# Altium schematic sheet 06)LCD.SchDoc
size 292 x 193 mm
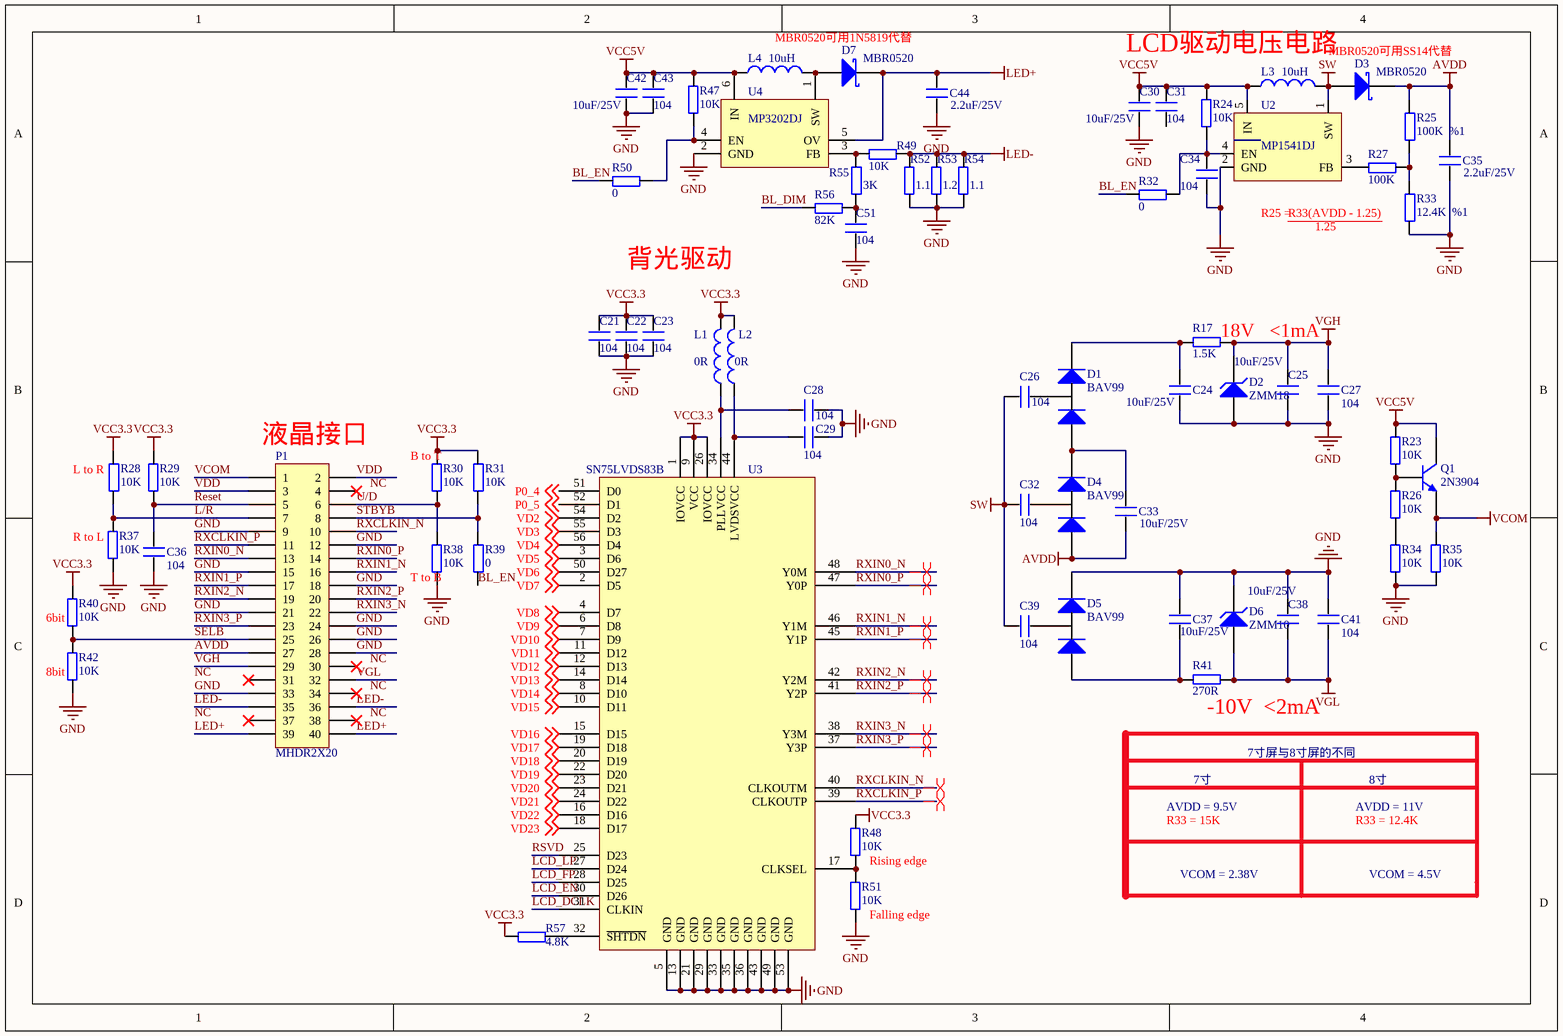
[diagram p0: 06)LCD.SchDoc]

## Parts
C21  104  [0603P]
C22  104  [0603P]
C23  104  [0603P]
C24  10uF/25V  [1206]
C25  10uF/25V  [1206]
C26  104  [0603P]
C27  104  [0603P]
C28  104  [0603P]
C29  104  [0603P]
C30  10uF/25V  [1206]
C31  104  [0603P]
C32  104  [0603P]
C33  10uF/25V  [1206]
C34  104  [0603P]
C35  2.2uF/25V  [1206]
C36  104  [0603P]
C37  10uF/25V  [1206]
C38  10uF/25V  [1206]
C39  104  [0603P]
C41  104  [0603P]
C42  10uF/25V  [1206]
C43  104  [0603P]
C44  2.2uF/25V  [1206]
C51  104  [0603P]
D1  BAV99  [SOT-23-3L]
D2  ZMM18  [LL-34]
D3  MBR0520  [DSO-C2/X2.3]
D4  BAV99  [SOT-23-3L]
D5  BAV99  [SOT-23-3L]
D6  ZMM10  [LL-34]
D7  MBR0520  [DSO-C2/X2.3]
L1  value 0R  [0603P]  (hidden comment: Inductor)
L2  value 0R  [0603P]  (hidden comment: Inductor)
L3  value 10uH  [1206]  (hidden comment: Inductor)
L4  value 10uH  [1206]  (hidden comment: Inductor)
P1  MHDR2X20  [FH12A-40S-0.5SH]
Q1  2N3904  [SOT-23-3L]
R17  1.5K  [0603P]
R23  10K  [0603P]
R24  10K  [0603P]
R25  100K  %1  [0603P]
R26  10K  [0603P]
R27  100K  [0603P]
R28  10K  [0603P]
R29  10K  [0603P]
R30  10K  [0603P]
R31  10K  [0603P]
R32  0  [0603P]
R33  12.4K  %1  [0603P]
R34  10K  [0603P]
R35  10K  [0603P]
R37  10K  [0603P]
R38  10K  [0603P]
R39  0  [0603P]
R40  10K  [0603P]
R41  270R  [0603P]
R42  10K  [0603P]
R47  10K  [0603P]
R48  10K  [0603P]
R49  10K  [0603P]
R50  0  [0603P]
R51  10K  [0603P]
R52  1.1  [0603P]
R53  1.2  [0603P]
R54  1.1  [0603P]
R55  3K  [0603P]
R56  82K  [0603P]
R57  4.8K  [0603P]
U2  MP1541DJ  [SOT-23-5L]
U3  SN75LVDS83B  [DGG056]
U4  MP3202DJ  [SOT-23-6L]

## Nets
AVDD: C33.2 C35.1 D3.2(K) D4.1(A) P1.27 R25.2
GND: C21.1 C22.1 C23.1 C24.2 C25.2 C27.2 C28.1 C29.1 C30.2 C34.1 C35.2 C36.1 C37.1 C38.1 C41.1 C42.2 C43.1 C44.2 C51.1 D2.1(A) D5.2(K) D6.2(K) P1.9 P1.12 P1.15 P1.18 P1.21 P1.24 P1.26 P1.28 P1.33 R33.1 R34.2 R35.2 R37.2 R38.2 R42.2 R51.2 R52.2 R53.2 R54.2 U2.2(GND) U3.5(GND) U3.13(GND) U3.21(GND) U3.29(GND) U3.33(GND) U3.35(GND) U3.36(GND) U3.43(GND) U3.49(GND) U3.53(GND) U4.2(GND)
LED+: C44.1 D7.2(K) P1.39 P1.40 U4.5(OV)
LED-: P1.35 P1.36 R49.2 R52.1 R53.1 R54.1
SW: C26.2 C32.1 C39.1 D3.1(A) L3.2 U2.1(SW)
VCC3.3: C21.2 C22.2 C23.2 L1.2 L2.2 R28.2 R29.1 R30.1 R31.2 R40.1 R48.1 R57.1 U3.1(IOVCC) U3.9(VCC) U3.26(IOVCC)
VCC5V: C30.1 C31.2 C42.1 C43.2 L3.1 L4.1 Q1.3(C) R23.1 R24.1 R47.1 U2.5(IN) U4.6(IN)
VCOM: P1.1 Q1.2(E) R35.1
VGH: C25.1 C27.1 D2.2(K) P1.29 R17.1
VGL: C38.2 C41.2 D6.1(A) P1.32 R41.1
BL_DIM: R56.1
BL_EN: R32.1 R39.1 R50.1
L/R: P1.7 R28.1 R37.1
LCD_DCLK: U3.31(CLKIN)
LCD_EN: U3.30(D26)
LCD_FP: U3.28(D25)
LCD_LP: U3.27(D24)
P0_4: U3.51(D0) ; off-sheet P0_4
P0_5: U3.52(D1) ; off-sheet P0_5
Reset: C36.2 P1.5 R29.2
RSVD: U3.25(D23)
RXCLKIN_N: P1.10 U3.40(CLKOUTM)
RXCLKIN_P: P1.11 U3.39(CLKOUTP)
RXIN0_N: P1.13 U3.48(Y0M)
RXIN0_P: P1.14 U3.47(Y0P)
RXIN1_N: P1.16 U3.46(Y1M)
RXIN1_P: P1.17 U3.45(Y1P)
RXIN2_N: P1.19 U3.42(Y2M)
RXIN2_P: P1.20 U3.41(Y2P)
RXIN3_N: P1.22 U3.38(Y3M)
RXIN3_P: P1.23 U3.37(Y3P)
SELB: P1.25 R40.2 R42.1
STBYB: P1.8 R31.1 R39.2
U/D: P1.6 R30.2 R38.1
VD2: U3.54(D2) ; off-sheet VD2
VD3: U3.55(D3) ; off-sheet VD3
VD4: U3.56(D4) ; off-sheet VD4
VD5: U3.3(D6) ; off-sheet VD5
VD6: U3.50(D27) ; off-sheet VD6
VD7: U3.2(D5) ; off-sheet VD7
VD8: U3.4(D7) ; off-sheet VD8
VD9: U3.6(D8) ; off-sheet VD9
VD10: U3.7(D9) ; off-sheet VD10
VD11: U3.11(D12) ; off-sheet VD11
VD12: U3.12(D13) ; off-sheet VD12
VD13: U3.14(D14) ; off-sheet VD13
VD14: U3.8(D10) ; off-sheet VD14
VD15: U3.10(D11) ; off-sheet VD15
VD16: U3.15(D15) ; off-sheet VD16
VD17: U3.19(D18) ; off-sheet VD17
VD18: U3.20(D19) ; off-sheet VD18
VD19: U3.22(D20) ; off-sheet VD19
VD20: U3.23(D21) ; off-sheet VD20
VD21: U3.24(D22) ; off-sheet VD21
VD22: U3.16(D16) ; off-sheet VD22
VD23: U3.18(D17) ; off-sheet VD23
VDD: P1.2 P1.3
NetC24_1: C24.1 D1.2(K) R17.2
NetC26_1: C26.1 D1.3(A)
NetC28_2: C28.2 L1.1 U3.34(PLLVCC)
NetC29_2: C29.2 L2.1 U3.44(LVDSVCC)
NetC32_2: C32.2 D4.3(A)
NetC33_1: C33.1 D1.1(A) D4.2(K)
NetC34_2: C34.2 R24.2 R32.2 U2.4(EN)
NetC37_2: C37.2 D5.1(A) R41.2
NetC39_2: C39.2 D5.3(A)
NetC51_2: C51.2 R55.1 R56.2
NetD7_1: D7.1(A) L4.2 U4.1(SW)
NetQ1_1: Q1.1(B) R23.2 R26.1
NetR25_1: R25.1 R27.2 R33.2
NetR26_2: R26.2 R34.1
NetR27_1: R27.1 U2.3(FB)
NetR47_2: R47.2 R50.2 U4.4(EN)
NetR48_2: R48.2 R51.1 U3.17(CLKSEL)
NetR49_1: R49.1 R55.2 U4.3(FB)
NetR57_2: R57.2 U3.32(~{SHTDN})

Not connected (* = marked no-connect by the designer): C31 1; P1 4* 30* 31* 34* 37* 38*

## Layout directives
differential pair: RXCLKIN_N, RXCLKIN_P, RXIN0_N, RXIN0_P, RXIN1_N, RXIN1_P, RXIN2_N, RXIN2_P, RXIN3_N, RXIN3_P

## Notes on the sheet
- MBR0520可用1N5819代替
- LCD驱动电压电路
- MBR0520可用SS14代替
- R25 =
- R33(AVDD - 1.25)
- 1.25
- 背光驱动
- (near R17) 18V   <1mA
- (near P1) 液晶接口
- (near R28) L to R
- (near R30) B to T
- (near R37) R to L
- (near R38) T to B
- (near R40) 6bit
- (near R42) 8bit
- (near R41) -10V  <2mA
- 7寸
- 7寸屏与8寸屏的不同
- 8寸
- AVDD = 9.5V
- R33 = 15K
- AVDD = 11V
- R33 = 12.4K
- Rising edge
- (near R51) Falling edge
- VCOM = 2.38V
- VCOM = 4.5V
- Labels drawn without touching a wire or pin: NC

## Library data of the parts
C21-C39 C41-C44 C51 = C
D2 D6 = D Zener: Zener Diode; Published: 8-Jun-2000; LatestRevisionDate: 17-Jul-2002; LatestRevisionNote: Re-released for DXP Platform.; PackageReference: DIODE-0.7; Publisher: Altium Limited
D3 D7 = D Schottky: Schottky Diode; Published: 8-Jun-2000; LatestRevisionDate: 17-Jul-2002; LatestRevisionNote: Re-released for DXP Platform.; PackageReference: SMB; Publisher: Altium Limited; Code_JEDEC: DO-214-AA
L1-L4 = Inductor: Code_IEC: 1005; Published: 8-Jun-2000; LatestRevisionDate: 29-May-2009; LatestRevisionNote: IPC-7351 Footprint Added.; PackageReference: 0402-A; Publisher: Altium Limited; PackageDescription: Chip Inductor; Code_JEITA: 0402
P1 = MHDR2X20: Header, 20-Pin, Dual row; LatestRevisionDate: 17-Jul-2002; LatestRevisionNote: Re-released for DXP Platform.; Publisher: Altium Limited
Q1 = 2N3904: NPN General Purpose Amplifier; Published: 8-Jun-2000; LatestRevisionDate: 15-Jan-2003; LatestRevisionNote: PCB Footprint 'BCY-W3/D4.7' replaced; DatasheetVersion: 1997; PackageVersion: Sep-1998; PackageReference: TO-92A; Publisher: Altium Limited; Code_JEDEC: TO-92A; ComponentLink1Description: Manufacturer Link; ComponentLink1URL: http://www.fairchildsemi.com/; ComponentLink2Description: Datasheet; ComponentLink2URL: http://www.fairchildsemi.com/ds/2N%2F2N3904.pdf
R17 R23-R35 R37-R42 R47-R57 = R
U2 = MP1541
U4 = MP3202